# Altium schematic sheet WL-FPGA.SchDoc
size 420 x 297 mm; Scale: 1:1; DocumentType: Схема электрическая принципиальная; FirstReferrence: UA3REO/R7KBI; DocumentNumber: 3; SheetNumber: 3; SheetTotal: 12
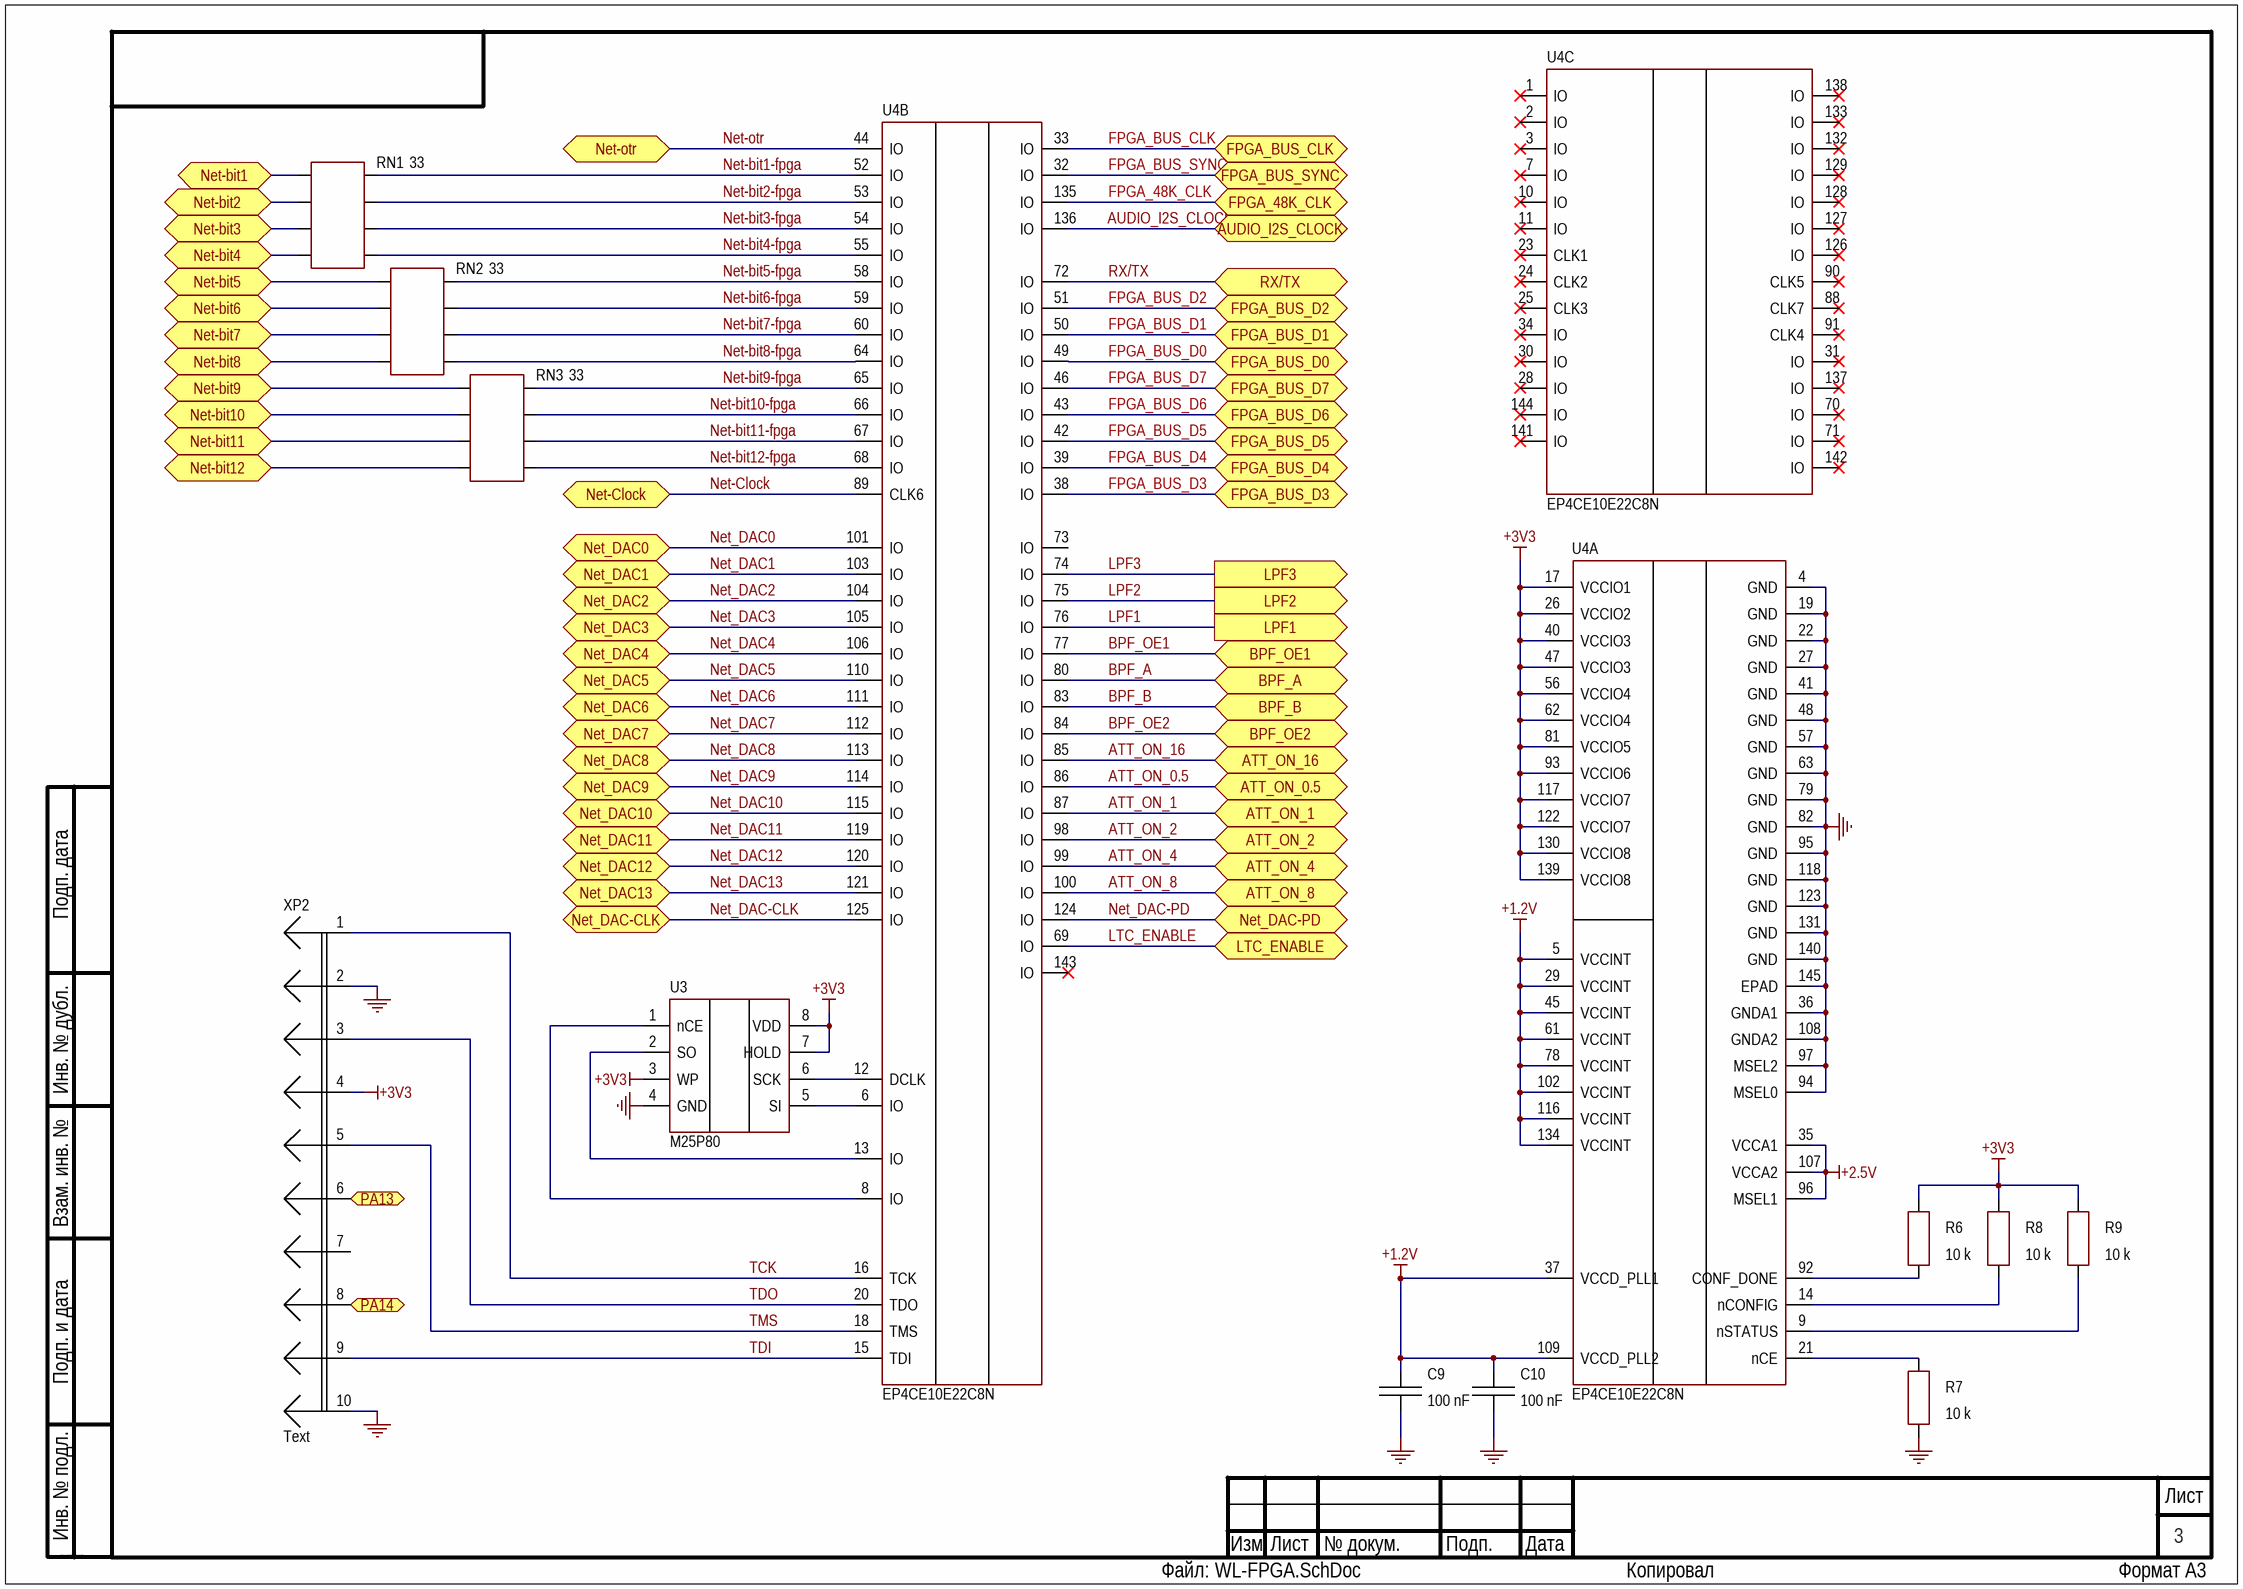
[diagram p0: WL-FPGA.SchDoc]

## Parts
C9  100 nF  [C-0805-0.95]
C10  100 nF  [C-0805-0.95]
R6  10 k  [R-0805]
R7  10 k  [R-0805]
R8  10 k  [R-0805]
R9  10 k  [R-0805]
RN1  33  [RN-1206]
RN2  33  [RN-1206]
RN3  33  [RN-1206]
U3  M25P80  [SOIC-8-W]
U4  EP4CE10E22C8N  [EQFP-144]  (parts A,B,C of 3)
XP2  Text  [PLD-10-JTAG-FPGA-SWD]

## Ports
ATT_ON_0.5 (bidir), ATT_ON_1 (bidir), ATT_ON_2 (bidir), ATT_ON_4 (bidir), ATT_ON_8 (bidir), ATT_ON_16 (bidir), AUDIO_I2S_CLOCK (bidir), BPF_A (bidir), BPF_B (bidir), BPF_OE1 (bidir), BPF_OE2 (bidir), FPGA_48K_CLK (bidir), FPGA_BUS_CLK (bidir), FPGA_BUS_D0 (bidir), FPGA_BUS_D1 (bidir), FPGA_BUS_D2 (bidir), FPGA_BUS_D3 (bidir), FPGA_BUS_D4 (bidir), FPGA_BUS_D5 (bidir), FPGA_BUS_D6 (bidir), FPGA_BUS_D7 (bidir), FPGA_BUS_SYNC (bidir), LPF1 (out), LPF2 (out), LPF3 (out), LTC_ENABLE (bidir), Net-bit1 (bidir), Net-bit2 (bidir), Net-bit3 (bidir), Net-bit4 (bidir), Net-bit5 (bidir), Net-bit6 (bidir), Net-bit7 (bidir), Net-bit8 (bidir), Net-bit9 (bidir), Net-bit10 (bidir), Net-bit11 (bidir), Net-bit12 (bidir), Net-Clock (bidir), Net-otr (bidir), Net_DAC0 (bidir), Net_DAC1 (bidir), Net_DAC2 (bidir), Net_DAC3 (bidir), Net_DAC4 (bidir), Net_DAC5 (bidir), Net_DAC6 (bidir), Net_DAC7 (bidir), Net_DAC8 (bidir), Net_DAC9 (bidir), Net_DAC10 (bidir), Net_DAC11 (bidir), Net_DAC12 (bidir), Net_DAC13 (bidir), Net_DAC-CLK (bidir), Net_DAC-PD (bidir), PA13 (bidir), PA14 (bidir), RX/TX (bidir)

## Nets
+1.2V: C9.2 C10.2 U4.5(VCCINT) U4.29(VCCINT) U4.37(VCCD_PLL1) U4.45(VCCINT) U4.61(VCCINT) U4.78(VCCINT) U4.102(VCCINT) U4.109(VCCD_PLL2) U4.116(VCCINT) U4.134(VCCINT)
+2.5V: U4.35(VCCA1) U4.96(MSEL1) U4.107(VCCA2)
+3V3: R6.1 R8.1 R9.1 U3.3(WP) U3.7(HOLD) U3.8(VDD) U4.17(VCCIO1) U4.26(VCCIO2) U4.40(VCCIO3) U4.47(VCCIO3) U4.56(VCCIO4) U4.62(VCCIO4) U4.81(VCCIO5) U4.93(VCCIO6) U4.117(VCCIO7) U4.122(VCCIO7) U4.130(VCCIO8) U4.139(VCCIO8) XP2.4
GND: C9.1 C10.1 R7.1 U3.4(GND) U4.4(GND) U4.19(GND) U4.22(GND) U4.27(GND) U4.36(GNDA1) U4.41(GND) U4.48(GND) U4.57(GND) U4.63(GND) U4.79(GND) U4.82(GND) U4.94(MSEL0) U4.95(GND) U4.97(MSEL2) U4.108(GNDA2) U4.118(GND) U4.123(GND) U4.131(GND) U4.140(GND) U4.145(EPAD) XP2.2 XP2.10
ATT_ON_0.5: U4.86(IO) ; port ATT_ON_0.5
ATT_ON_1: U4.87(IO) ; port ATT_ON_1
ATT_ON_2: U4.98(IO) ; port ATT_ON_2
ATT_ON_4: U4.99(IO) ; port ATT_ON_4
ATT_ON_8: U4.100(IO) ; port ATT_ON_8
ATT_ON_16: U4.85(IO) ; port ATT_ON_16
AUDIO_I2S_CLOCK: U4.136(IO) ; port AUDIO_I2S_CLOCK
BPF_A: U4.80(IO) ; port BPF_A
BPF_B: U4.83(IO) ; port BPF_B
BPF_OE1: U4.77(IO) ; port BPF_OE1
BPF_OE2: U4.84(IO) ; port BPF_OE2
FPGA_48K_CLK: U4.135(IO) ; port FPGA_48K_CLK
FPGA_BUS_CLK: U4.33(IO) ; port FPGA_BUS_CLK
FPGA_BUS_D0: U4.49(IO) ; port FPGA_BUS_D0
FPGA_BUS_D1: U4.50(IO) ; port FPGA_BUS_D1
FPGA_BUS_D2: U4.51(IO) ; port FPGA_BUS_D2
FPGA_BUS_D3: U4.38(IO) ; port FPGA_BUS_D3
FPGA_BUS_D4: U4.39(IO) ; port FPGA_BUS_D4
FPGA_BUS_D5: U4.42(IO) ; port FPGA_BUS_D5
FPGA_BUS_D6: U4.43(IO) ; port FPGA_BUS_D6
FPGA_BUS_D7: U4.46(IO) ; port FPGA_BUS_D7
FPGA_BUS_SYNC: U4.32(IO) ; port FPGA_BUS_SYNC
LPF1: U4.76(IO) ; port LPF1
LPF2: U4.75(IO) ; port LPF2
LPF3: U4.74(IO) ; port LPF3
LTC_ENABLE: U4.69(IO) ; port LTC_ENABLE
Net-bit1: RN1.1 ; port Net-bit1
Net-bit1-fpga: RN1.8 U4.52(IO)
Net-bit2: RN1.2 ; port Net-bit2
Net-bit2-fpga: RN1.7 U4.53(IO)
Net-bit3: RN1.3 ; port Net-bit3
Net-bit3-fpga: RN1.6 U4.54(IO)
Net-bit4: RN1.4 ; port Net-bit4
Net-bit4-fpga: RN1.5 U4.55(IO)
Net-bit5: RN2.1 ; port Net-bit5
Net-bit5-fpga: RN2.8 U4.58(IO)
Net-bit6: RN2.2 ; port Net-bit6
Net-bit6-fpga: RN2.7 U4.59(IO)
Net-bit7: RN2.3 ; port Net-bit7
Net-bit7-fpga: RN2.6 U4.60(IO)
Net-bit8: RN2.4 ; port Net-bit8
Net-bit8-fpga: RN2.5 U4.64(IO)
Net-bit9: RN3.1 ; port Net-bit9
Net-bit9-fpga: RN3.8 U4.65(IO)
Net-bit10: RN3.2 ; port Net-bit10
Net-bit10-fpga: RN3.7 U4.66(IO)
Net-bit11: RN3.3 ; port Net-bit11
Net-bit11-fpga: RN3.6 U4.67(IO)
Net-bit12: RN3.4 ; port Net-bit12
Net-bit12-fpga: RN3.5 U4.68(IO)
Net-Clock: U4.89(CLK6) ; port Net-Clock
Net-otr: U4.44(IO) ; port Net-otr
Net_DAC0: U4.101(IO) ; port Net_DAC0
Net_DAC1: U4.103(IO) ; port Net_DAC1
Net_DAC2: U4.104(IO) ; port Net_DAC2
Net_DAC3: U4.105(IO) ; port Net_DAC3
Net_DAC4: U4.106(IO) ; port Net_DAC4
Net_DAC5: U4.110(IO) ; port Net_DAC5
Net_DAC6: U4.111(IO) ; port Net_DAC6
Net_DAC7: U4.112(IO) ; port Net_DAC7
Net_DAC8: U4.113(IO) ; port Net_DAC8
Net_DAC9: U4.114(IO) ; port Net_DAC9
Net_DAC10: U4.115(IO) ; port Net_DAC10
Net_DAC11: U4.119(IO) ; port Net_DAC11
Net_DAC12: U4.120(IO) ; port Net_DAC12
Net_DAC13: U4.121(IO) ; port Net_DAC13
Net_DAC-CLK: U4.125(IO) ; port Net_DAC-CLK
Net_DAC-PD: U4.124(IO) ; port Net_DAC-PD
PA13: XP2.6 ; port PA13
PA14: XP2.8 ; port PA14
RX/TX: U4.72(IO) ; port RX/TX
TCK: U4.16(TCK) XP2.1
TDI: U4.15(TDI) XP2.9
TDO: U4.20(TDO) XP2.3
TMS: U4.18(TMS) XP2.5
NetR6_2: R6.2 U4.92(CONF_DONE)
NetR7_2: R7.2 U4.21(nCE)
NetR8_2: R8.2 U4.14(nCONFIG)
NetR9_2: R9.2 U4.9(nSTATUS)
NetU3_1: U3.1(nCE) U4.8(IO)
NetU3_2: U3.2(SO) U4.13(IO)
NetU3_5: U3.5(SI) U4.6(IO)
NetU3_6: U3.6(SCK) U4.12(DCLK)

Not connected (* = marked no-connect by the designer): U4 1(IO)* 2(IO)* 3(IO)* 7(IO)* 10(IO)* 11(IO)* 23(CLK1)* 24(CLK2)* 25(CLK3)* 28(IO)* 30(IO)* 31(IO)* 34(IO)* 70(IO)* 71(IO)* 73(IO) 88(CLK7)* 90(CLK5)* 91(CLK4)* 126(IO)* 127(IO)* 128(IO)* 129(IO)* 132(IO)* 133(IO)* 137(IO)* 138(IO)* 141(IO)* 142(IO)* 143(IO)* 144(IO)*; XP2 7

## Notes on the sheet
- Подп. дата
- Инв. № дубл.
- Взам. инв. №
- Подп. и дата
- Инв. № подл.
- Изм.
- Лист
- № докум.
- Подп.
- Дата
- ALTIUM GOSTBOM2.0 KEV
- Файл:
- Копировал
- Формат А3

## Library data of the parts
C9 C10 = CC0805KRX7R9BB104: Manufacturer: Yageo; Value: 100; Type: Конденсатор; Dielectric: X7R; Tolerance: ±10%; Voltage: 50 V; CommentDOC: ( CC - 0805 - X7R - 50 V - 100 nF ±10% ); Part Number: CC0805KRX7R9BB104; Units: nF; Case: 0805; Operating Temperature: -55 ... 125 °C; Series: CC; Value+Units: 100 nF; ValueSCH: 100 nF; ( Series - Case - Dielectric -  Voltage - Value+Units Tolerance: ( CC - 0805 - X7R - 50 V - 100 nF ±10% )
R6-R9 = RC0805JR-0710KL: Manufacturer: Yageo; Value: 10; Power: 0,125 W; Units: kOhm; Tolerance: ±5%; Operating Voltage: 150 V; Value+Units: 10 kOhm; CommentDOC: ( RC - 0805 - 0,125 W - 10 kOhm  ±5% ); Type: Резистор; Part Number: RC0805JR-0710KL; Case: 0805; Operating Temperature: -55°C ... 155°C; ValueSCH: 10 k; Series: RC
RN1-RN3 = YC164-JR-0733RL: Manufacturer: Yageo; Power: 1/16W; Units: Ohm; Tolerance: ±5%; Value+Units: 33 Ohm; Type: Резистивная сборка; Part Number: YC164-JR-0733RL; Value: 33; Case: 1206; Operating Temperature: -55°C ... 155°C; ValueSCH: 33; Series: YC164
U3 = M25P80-VMW6: IC FLASH 8MBIT SPI 75MHZ; Manufacturer: Micron Technology Inc.; Voltage  Supply: +2,7 V … 3,6 V; Part Number: M25P80-VMW6; ValueSCH: M25P80; Function: IC FLASH 8MBIT SPI 75MHZ; Case: SOIC-8-W; Operating Temperature: -40°С ... 85°С; Type: Микросхема
U4 = EP4CE10E22C8N: Manufacturer: Intel; Function: IC FPGA 91 I/O; Voltage  Supply: 1.15V … 1.25V; Part Number: EP4CE10E22C8N; Case: EQFP-144; Operating Temperature: 0°C …  85°C; Type: Микросхема
XP2 = PLD-10: Part Number: PLD-10; Pitch: 2,54 mm; Type: Вилка; Number of Pins: 10